# Altium schematic sheet v1.0.SchDoc
size 101 x 50 mm
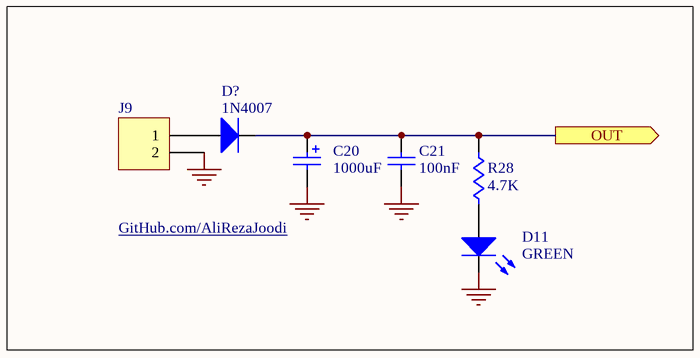
[diagram p0: v1.0.SchDoc]

## Parts
C20  1000uF  [CAPPR5-10x12.5]
C21  100nF  [CAPNTO2.54-3.05x1.78A]
D11  GREEN  [LED-5mm_Red]
D?  1N4007  [DIODE0.5_]
J9  2PIN  [Fonics_2PIN_1]  (value not drawn)
R28  4.7K  [AXIAL-0.4]

## Ports
OUT (out)

## Nets
GND: C20.2 C21.1 D11.2(K) J9.2
OUT: C20.1 C21.2 D?.2(K) R28.1 ; port OUT
NetD11_1: D11.1(A) R28.2
NetD?_1: D?.1(A) J9.1

## Notes on the sheet
- GitHub.com/AliRezaJoodi

## Library data of the parts
C20 = Cap Pol1: Polarized Capacitor (Radial); Manufacturer: Generic Components; Class I: Passive; Published: 8-Jun-2000; Revision: July-2002: Re-released for DXP Platform.; Publisher: Altium Limited; Class II: Capacitor
C21 = Cap: Capacitor; Manufacturer: Generic Components; Class I: Passive; Published: 8-Jun-2000; Revision: July-2002: Re-released for DXP Platform.; Publisher: Altium Limited; Class II: Capacitor
D11 = LED: Typical INFRARED GaAs LED; Manufacturer: Generic Components; Class I: Optoelectronic; Published: 8-Jun-2000; Revision: July-2002: Re-released for DXP Platform.; Publisher: Altium Limited; Class II: LED
D? = Diode: Default Diode; Manufacturer: Generic Components; Class I: Discrete; Class II: Diode - Switching; Published: 8-Jun-2000; Revision: July-2002: Re-released for DXP Platform.; Publisher: Altium Limited
J9 = Header 2: Header, 2-Pin; LatestRevisionDate: 17-Jul-2002; LatestRevisionNote: Re-released for DXP Platform.; Publisher: Altium Limited
R28 = Res1: Resistor; Manufacturer: Generic Components; Class I: Passive; Published: 8-Jun-2000; Revision: July-2002: Re-released for DXP Platform.; Publisher: Altium Limited; Class II: Resistor